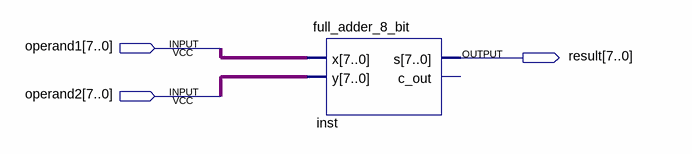
[diagram p0: schematic sheet]
// Quartus schematic ALU.bdf as structural Verilog: 1 symbols, 3 pins
module ALU (
  input  [7:0] operand1,
  input  [7:0] operand2,
  output [7:0] result
);

  full_adder_8_bit inst (.x(operand1), .y(operand2), .s(result));  // open: c_out
endmodule
